# EAGLE design LowLevelv2 (EAGLE 8.1.0)

## Sheet 1 of 2
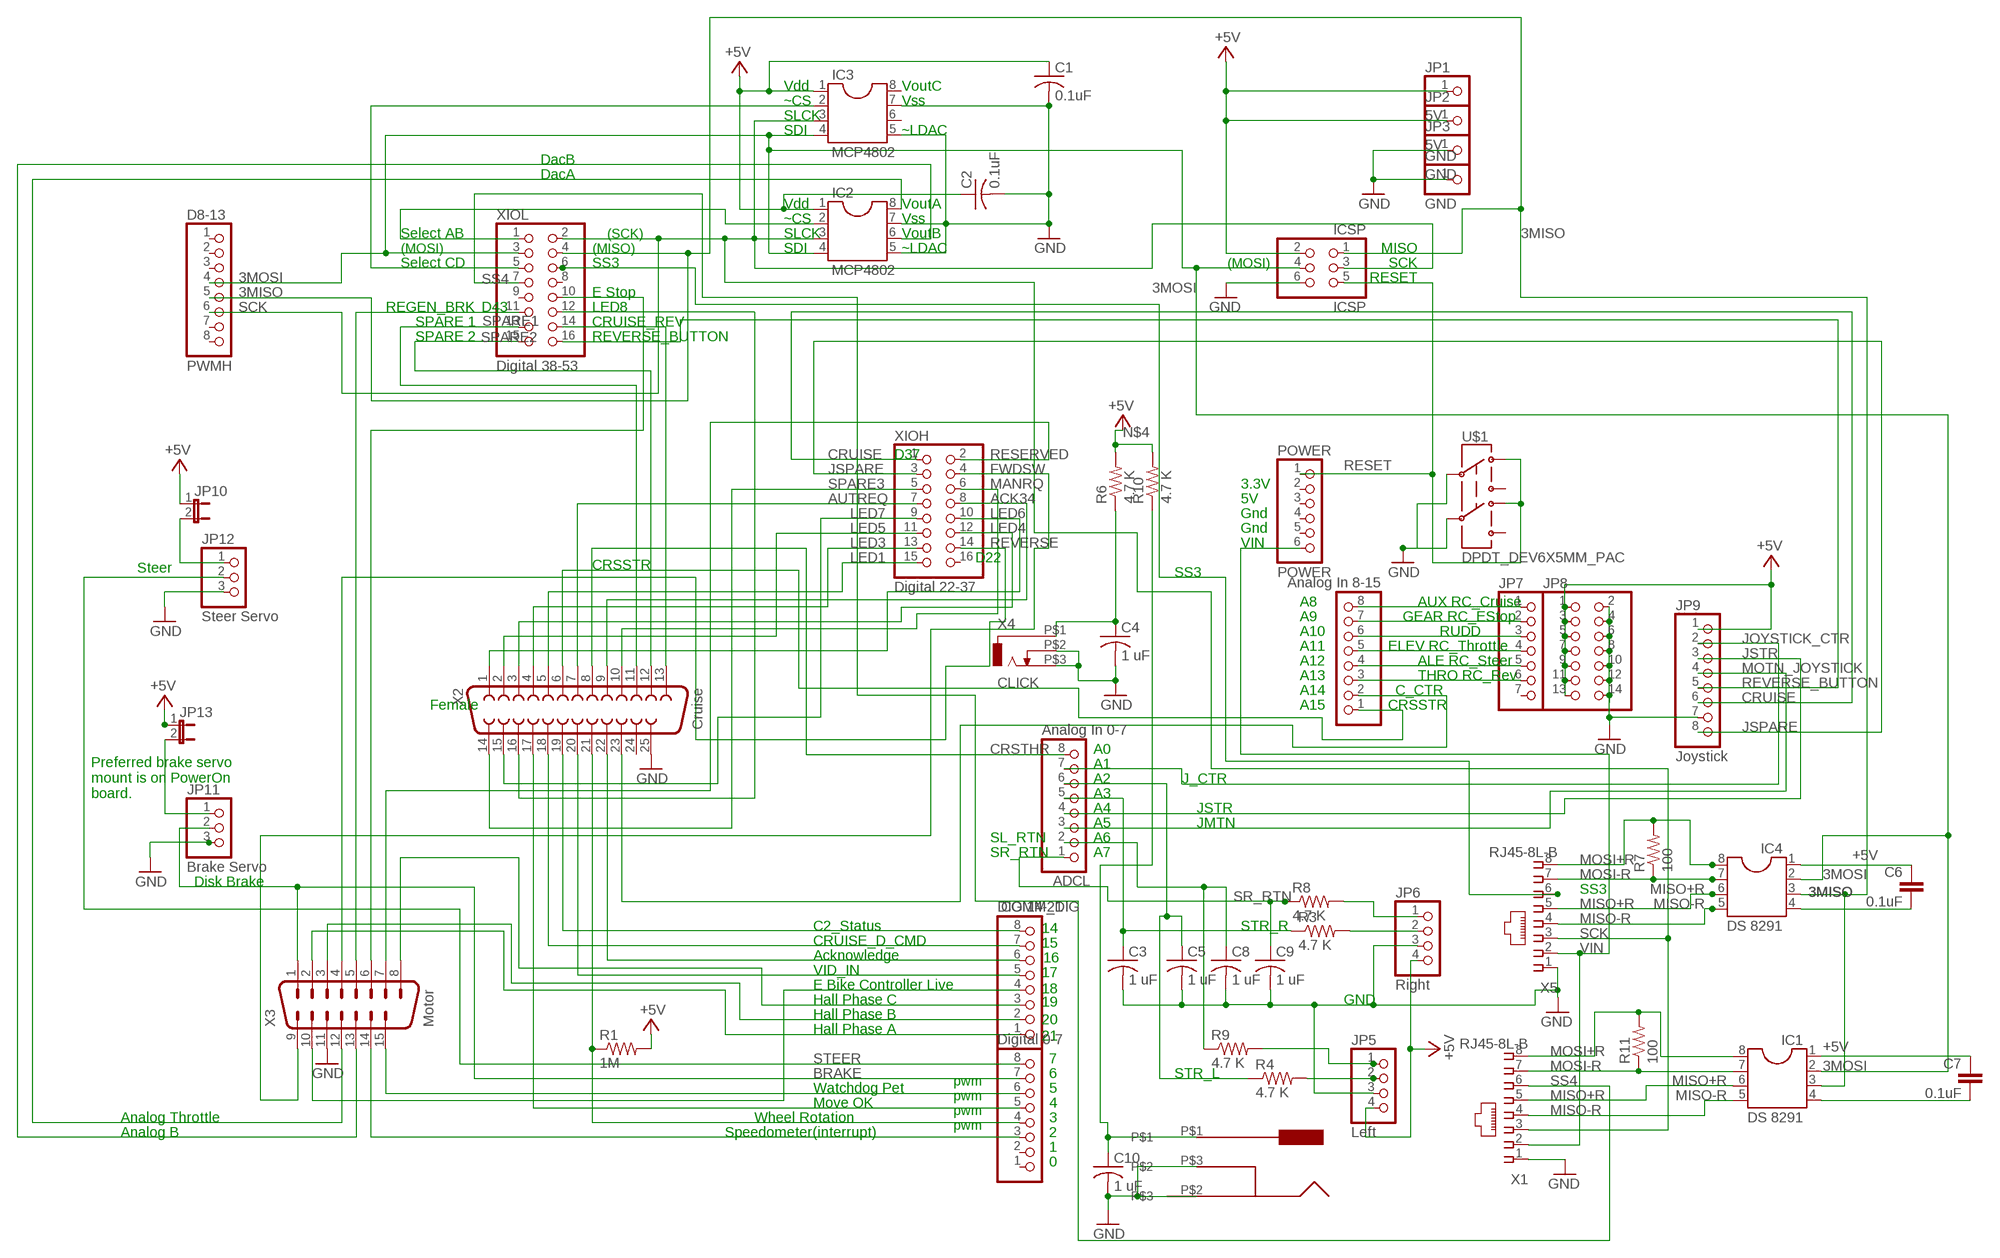
[diagram p0: schematic, sheet 1]

### Parts
ADCH  Analog In 8-15  PINHD-1X8  [1X08]
ADCL  Analog In 0-7  PINHD-1X8  [1X08]
C1  0.1uF  C-US025-025X050  [C025-025X050]
C2  0.1uF  C-US025-025X050  [C025-025X050]
C3  1 uF  C-US025-030X050  [C025-030X050]
C4  1 uF  C-US025-030X050  [C025-030X050]
C5  1 uF  C-US025-030X050  [C025-030X050]
C6  0.1uF  C2.5/2  [C2.5-2]
C7  0.1uF  C2.5/2  [C2.5-2]
C8  1 uF  C-US025-030X050  [C025-030X050]
C9  1 uF  C-US025-030X050  [C025-030X050]
C10  1 uF  C-US025-030X050  [C025-030X050]
COMM_DIG  DIG 14-21  PINHD-1X8  [1X08]
D8-13  PWMH  PINHD-1X8  [1X08]
GND  GND  PINHD-1X1  [1X01]
IC1  DS 8291  DIL8  [DIL08]
IC2  MCP4802  DIL8  [DIL08]
IC3  MCP4802  DIL8  [DIL08]
IC4  DS 8291  DIL8  [DIL08]
ICSP  ICSP  PINHD-2X3  [2X03]
JP1  5V  PINHD-1X1  [1X01]
JP2  5V  PINHD-1X1  [1X01]
JP3  GND  PINHD-1X1  [1X01]
JP5  Left  PINHD-1X4/90  [1X04/90]
JP6  Right  PINHD-1X4/90  [1X04/90]
JP7  PINHD-1X7  [1X07]
JP8  PINHD-2X7  [2X07]
JP9  Joystick  PINHD-1X8/90  [1X08/90]
JP10  JP1E  [JP1]
JP11  Brake Servo  PINHD-1X3/90  [1X03/90]
JP12  Steer Servo  PINHD-1X3/90  [1X03/90]
JP13  JP1E  [JP1]
POWER  POWER  PINHD-1X6  [1X06]
PWML  Digital 0-7  PINHD-1X8  [1X08]
R1  1M  R-US_0207/10  [0207/10]
R3  4.7 K  R-US_0207/10  [0207/10]
R4  4.7 K  R-US_0207/10  [0207/10]
R6  4.7 K  R-US_0207/10  [0207/10]
R7  100  R-US_0207/10  [0207/10]
R8  4.7 K  R-US_0207/10  [0207/10]
R9  4.7 K  R-US_0207/10  [0207/10]
R10  4.7 K  R-US_0207/10  [0207/10]
R11  100  R-US_0207/10  [0207/10]
U$1  DPDT_DEV6X5MM_PAC  [NEWSWITCH2_PAC]
U$2  CUI_JACKTHROUGH_HOLE  [CUIJACK]
X1  RJ45-8L-B  [RJ45-NO-SHIELD]
X2  Cruise  F25H  [F25H]
X3  Motor  M15-182  [182-015-MALE]
X4  CLICK  ODO_JACK  [ODO_JACK]
X5  RJ45-8L-B  [RJ45-NO-SHIELD]
XIOH  Digital 22-37  PINHD-2X8  [2X08]
XIOL  Digital 38-53  PINHD-2X8  [2X08]

### Nets
1C: ADCH.6 JP7.3
3A: ADCH.3 JP7.6
3MISO: D8-13.5 IC1.3 IC4.3 ICSP.1 XIOL.4
3MOSI: D8-13.4 IC1.2 IC2.4 IC3.4 IC4.2 ICSP.4 XIOL.3
5V: JP10.2 JP12.1
5VOLT: JP11.1 JP13.2
+5V: C1.1 C2.1 C6.1 IC2.1 IC3.1 IC4.1 ICSP.2 JP1.1 JP2.1 JP5.4 JP6.4 JP8.1 JP8.3 JP8.5 JP8.7 JP8.9 JP8.11 JP8.13 JP9.1 JP10.1 JP13.1 R1.2 R6.2 R10.2
A14: ADCH.7 JP7.2
A15: ADCH.8 JP7.1
ACK34: X2.9 XIOH.8
ACKNOWLEDGE: COMM_DIG.6 X2.22
AUTREQ: X2.7 XIOH.7
BRAKE: JP11.2 PWML.7 X3.1
C2STATUS: COMM_DIG.8 X2.19
C_CTR: ADCH.2 X2.23
CRSSTR: ADCH.1 X2.6
CRSTHR: ADCL.8 X2.8
CRUISE: JP9.6 XIOH.1
CRUISE_D_CMD: COMM_DIG.7 X2.18
CRUISE_REV: X2.13 XIOL.14
DACA: IC2.8 X3.12
DACB: IC2.6 X3.13
EBIKECONTRL: COMM_DIG.4 X3.10
ESTOP: X3.6 XIOL.10
FWDSW: X3.9 XIOH.4
GND: C1.2 C2.2 C3.2 C4.2 C5.2 C8.2 C9.2 C10.2 GND.1 IC2.5 IC2.7 IC3.5 IC3.7 ICSP.6 JP3.1 JP5.3 JP6.3 JP8.2 JP8.4 JP8.6 JP8.8 JP8.10 JP8.12 JP8.14 JP9.7 JP11.3 JP12.3 U$1.PIN2 U$1.PIN5 U$2.P$2 U$2.P$3 X1.1 X2.25 X3.11 X4.P$2 X4.P$3 X5.1
HALLPHASEA: COMM_DIG.1 X3.2
HALLPHASEB: COMM_DIG.2 X3.3
HALLPHASEC: COMM_DIG.3 X3.8
JOYSTICK_CTR: ADCL.7 JP9.2
JSPARE: JP9.8 XIOH.3
JSTR: ADCL.4 JP9.3
L_STR: JP5.2 R4.2
LED1: X2.5 XIOH.15
LED3: X2.4 XIOH.13
LED4: X2.3 XIOH.12
LED5: X2.2 XIOH.11
LED6: X2.1 XIOH.10
LED7: X2.15 XIOH.9
LED8: X2.16 XIOL.12
MANRQ: X2.10 XIOH.6
MISO+R: IC1.6 IC4.6 X1.5 X5.5
MISO-R: IC1.5 IC4.5 X1.4 X5.4
MOSI+R: IC1.8 IC4.8 R7.2 R11.2 X1.8 X5.8
MOSI-R: IC1.7 IC4.7 R7.1 R11.1 X1.7 X5.7
MOTN_JOYSTICK: ADCL.3 JP9.4
MOVEOK: PWML.5 X2.17
N$1: C10.1 R10.1 U$2.P$1
N$2: C6.2 IC4.4
N$3: C7.2 IC1.4
N$4: C4.1 R6.1 X4.P$1
N$5: C7.1 IC1.1
N$27: ADCH.4 JP7.5
N$28: ADCH.5 JP7.4
R_STR: JP6.2 R3.2
REGENBAKE: X3.5 XIOL.11
RESERVED: X3.7 XIOH.2
RESET: ICSP.5 POWER.1 U$1.PIN1 U$1.PIN4
REVERSE: X3.4 XIOH.14
REVERSE_BUTTON: JP9.5 XIOL.16
SCK: D8-13.6 IC2.3 IC3.3 ICSP.3 X1.3 X5.3 XIOL.2
SELECTAB: IC2.2 XIOL.1
SELECTCD: IC3.2 XIOL.5
SL_RET: JP5.1 R9.2
SL_RTN: ADCL.2 C8.1 R9.1
SPARE1: X2.11 XIOL.13
SPARE2: X2.12 XIOL.15
SPARE3: X2.14 XIOH.5
SPEEDOMETER: PWML.3 X3.14
SR_RET: JP6.1 R8.2
SR_RTN: ADCL.1 C9.1 R8.1
SS3: X5.6 XIOL.6
SS4: X1.6 XIOL.7
STEER: JP12.2 PWML.8
STR_L: ADCL.6 C5.1 R4.1
STR_R: ADCL.5 C3.1 R3.1
VIDIN: COMM_DIG.5 X2.20
VIN: POWER.6 X1.2 X5.2
WATCHDOG: PWML.6 X3.15
WHEELROTATION: PWML.4 R1.1 X2.21
Unconnected: D8-13.1 D8-13.2 D8-13.3 D8-13.7 D8-13.8 IC3.6 IC3.8 JP7.7 POWER.2 POWER.3 POWER.4 POWER.5 PWML.1 PWML.2 U$1.PIN3 U$1.PIN6 X2.24 XIOH.16 XIOL.8 XIOL.9

### Notes on the sheet
- Vdd | VoutC
- ~CS | Vss
- SLCK
- SDI | ~LDAC
- DacB
- DacA
- Vdd | VoutA
- ~CS | Vss
- Select AB | (SCK) | SLCK | VoutB
- (MOSI) | (MISO) | SDI | ~LDAC | MISO
- Select CD | SS3 | (MOSI) | SCK
- RESET
- E Stop
- REGEN_BRK | D43
- SPARE 1
- SPARE 2
- D37
- 3.3V
- 5V
- Gnd
- Gnd
- VIN
- Steer | D22
- CRSSTR
- SS3
- A8 | AUX RC_Cruise
- A9 | GEAR RC_EStop
- A10 | RUDD
- A11 | ELEV RC_Throttle
- A12 | ALE RC_Steer
- A13 | THRO RC_Rev
- A14 | C_CTR
- Female | A15 | CRSSTR
- A0
- A1
- A2 | J_CTR
- Preferred brake servo
  mount is on PowerOn
  board.
- A3
- A4 | JSTR
- A5 | JMTN
- SL_RTN | A6
- SR_RTN | A7
- Disk Brake
- SS3
- C2_Status | 14 | STR_R
- 15
- Acknowledge | 16
- VID_IN | 17
- E Bike Controller Live | 18
- Hall Phase C | 19 | GND
- Hall Phase B
- 20
- Hall Phase A
- 21
- 7
- 6 | STR_L
- pwm
- Watchdog Pet | 5
- pwm
- Move OK | 4
- pwm
- Analog Throttle | Wheel Rotation | 3
- pwm
- Analog B | Speedometer(interrupt) | 2
- 1
- 0

## Sheet 2 of 2

## Library data of the parts
ADCH ADCL COMM_DIG D8-13 JP9 PWML = pinhead:PINHD-1X8: PIN HEADER
C1-C5 C8-C10 = rcl:C-US: CAPACITOR, American symbol
C6 C7 = capacitor-wima:C: CAPACITOR naming: grid - package width
GND JP1-JP3 = pinhead:PINHD-1X1: PIN HEADER
IC1-IC4 = ic-package:DIL8: Dual In Line / Socket
ICSP = pinhead:PINHD-2X3: PIN HEADER
JP5 JP6 = pinhead:PINHD-1X4: PIN HEADER
JP7 = pinhead:PINHD-1X7: PIN HEADER
JP8 = pinhead:PINHD-2X7: PIN HEADER
JP10 JP13 = jumper:JP1E: JUMPER
JP11 JP12 = pinhead:PINHD-1X3: PIN HEADER
POWER = pinhead:PINHD-1X6: PIN HEADER
R1 R3 R4 R6-R11 = rcl:R-US_: RESISTOR, American symbol
U$1 = elcanoParts:DPDT_DEV
U$2 = Elcano:CUI_JACK
X1 X5 = con-tycoelectronics:RJ45: CORCOM Modular RJ Jacks No Shield Source: www.tycoelectronics.com .. ENG_DS_1654001_1099_RJ_L_0507.pdf; MF: TYCO ELECTRONICS; MPN: RJ45-8L-B; OC_FARNELL: 1279843; OC_NEWARK: 52K4445
X2 = con-subd:F25: SUB-D; OC_FARNELL: unknown; OC_NEWARK: unknown
X3 = con-subd:M15: SUB-D; OC_FARNELL: unknown; OC_NEWARK: unknown
X4 = Elcano:ODO_JACK
XIOH XIOL = pinhead:PINHD-2X8: PIN HEADER

## Net classes
0 default: width 0.178 mm, drill 0.305 mm, clearance 0.178 mm
1 Power: width 0.508 mm, drill 0.305 mm, clearance 0.254 mm

## Board
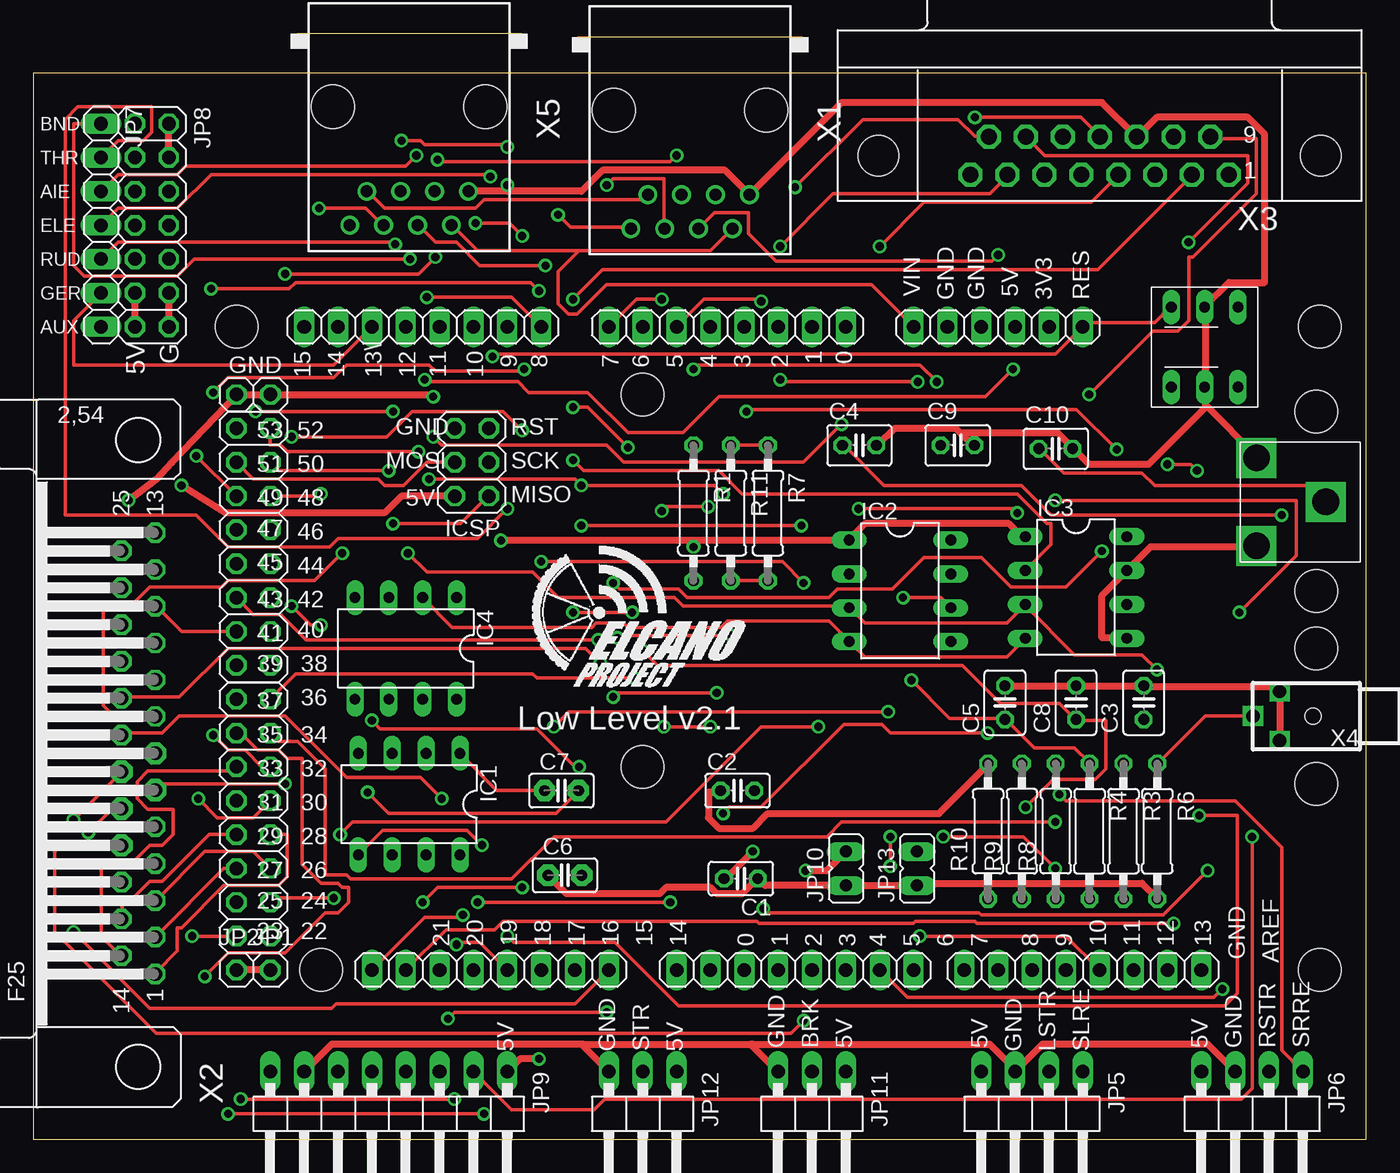
[diagram p1: board, top side]
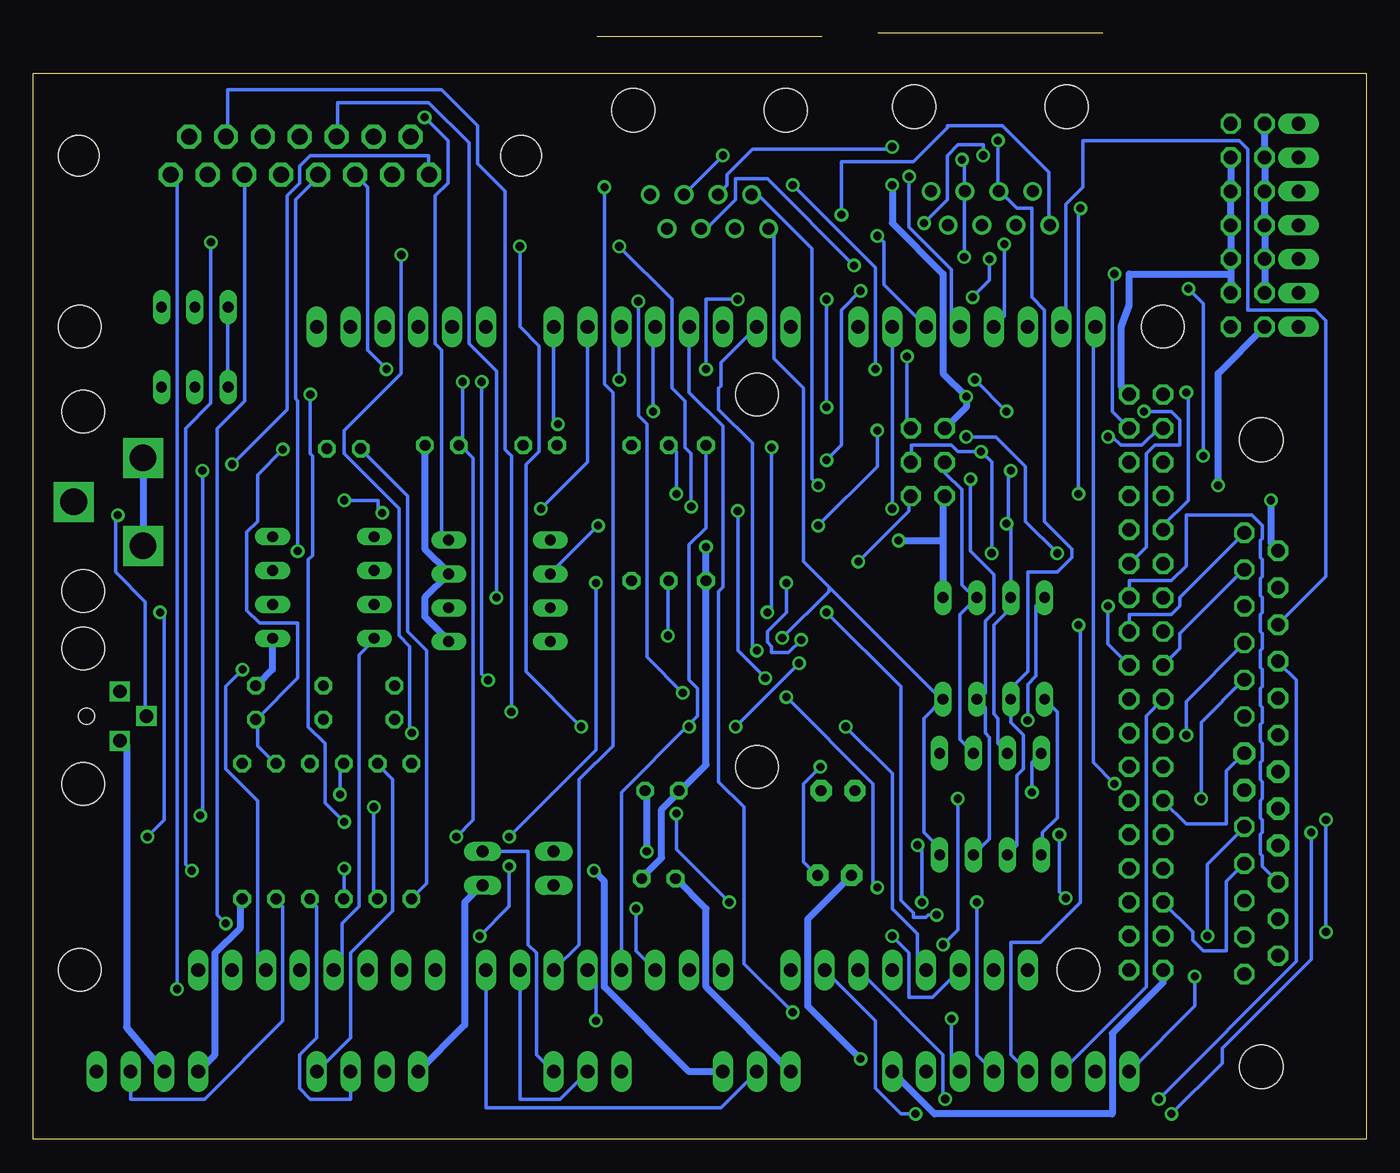
[diagram p2: board, bottom side, seen from below]

Size 100 x 80 mm. Coordinates in mm from the lower left corner, seen from the top.
Outline: 0,0 100,0 100,80 0,80 0,0
Copper layers (1*16): Top 0.035mm / dielectric 1.5mm / Bottom 0.035mm
Design rules "default": minimum track width 10mil, minimum drill 24mil, track to track 8mil, track to pad 8mil, pad to pad 8mil, via to via 8mil, smd to smd 8mil, copper to edge 40mil, drill to drill 8mil, minimum pad ring 10mil, minimum via ring 8mil, stop-mask expansion 4mil, vias tented up to drill 0mil, thermal gap 10mil
Holes 3.2 mm at 96.27,36.83 96.27,26.67 96.27,41.15 96.27,54.61 21.59,12.7 96.52,12.7 15.24,60.96 96.52,60.96 45.72,55.88 45.72,27.94

### Footprints (pad centres in the part's own frame; a part is rotated, then mirrored left to right if it is on the bottom)
1X08 = drill 1.016 long: 1 -8.89,0; 2 -6.35,0; 3 -3.81,0; 4 -1.27,0; 5 1.27,0; 6 3.81,0; 7 6.35,0; 8 8.89,0
C025-025X050 = drill 0.813 octagon: 1 -1.27,0; 2 1.27,0
C025-030X050 = drill 0.813 octagon: 1 -1.27,0; 2 1.27,0
C2.5-2 = drill 0.813 pad 1.6 octagon: 1 -1.27,0; 2 1.27,0
1X01 = drill 1.016 octagon: 1 0,0
DIL08 = drill 0.813 long: 1 -3.81,-3.81; 2 -1.27,-3.81; 3 1.27,-3.81; 4 3.81,-3.81; 5 3.81,3.81; 6 1.27,3.81; 7 -1.27,3.81; 8 -3.81,3.81
2X03 = drill 1.016 octagon: 1 -2.54,-1.27; 2 -2.54,1.27; 3 0,-1.27; 4 0,1.27; 5 2.54,-1.27; 6 2.54,1.27
1X04/90 = drill 1.016 long: 1 -3.81,-3.81; 2 -1.27,-3.81; 3 1.27,-3.81; 4 3.81,-3.81
1X07 = drill 1.016 long: 1 -7.62,0; 2 -5.08,0; 3 -2.54,0; 4 0,0; 5 2.54,0; 6 5.08,0; 7 7.62,0
2X07 = drill 1.016 octagon: 1 -7.62,-1.27; 2 -7.62,1.27; 3 -5.08,-1.27; 4 -5.08,1.27; 5 -2.54,-1.27; 6 -2.54,1.27; 7 0,-1.27; 8 0,1.27; 9 2.54,-1.27; 10 2.54,1.27; 11 5.08,-1.27; 12 5.08,1.27; 13 7.62,-1.27; 14 7.62,1.27
1X08/90 = drill 1.016 long: 1 -8.89,-3.81; 2 -6.35,-3.81; 3 -3.81,-3.81; 4 -1.27,-3.81; 5 1.27,-3.81; 6 3.81,-3.81; 7 6.35,-3.81; 8 8.89,-3.81
JP1 = drill 0.914 long: 1 0,-1.27; 2 0,1.27
1X03/90 = drill 1.016 long: 1 -2.54,-3.81; 2 0,-3.81; 3 2.54,-3.81
1X06 = drill 1.016 long: 1 -6.35,0; 2 -3.81,0; 3 -1.27,0; 4 1.27,0; 5 3.81,0; 6 6.35,0
0207/10 = drill 0.813 octagon: 1 -5.08,0; 2 5.08,0
NEWSWITCH2_PAC = drill 0.8 long: PIN1 -2.5,3; PIN2 0,3; PIN3 2.5,3; PIN4 -2.5,-3; PIN5 0,-3; PIN6 2.5,-3
CUIJACK = drill 2 pad 2.184 square: P$1 2.6,4.5; P$2 7.8,1.2; P$3 7.8,7.8
RJ45-NO-SHIELD = drill 0.9 pad 1.4: 1 -4.445,6.35; 2 -3.175,8.89; 3 -1.905,6.35; 4 -0.635,8.89; 5 0.635,6.35; 6 1.905,8.89; 7 3.175,6.35; 8 4.445,8.89 | hole 3.251: -5.715,0; 5.715,0
F25H = drill 1.016 octagon: 1 -16.561,-1.27; 2 -13.792,-1.27; 3 -11.049,-1.27; 4 -8.28,-1.27; 5 -5.512,-1.27; 8 2.769,-1.27; 9 5.512,-1.27; 10 8.28,-1.27; 11 11.049,-1.27; 12 13.792,-1.27; 13 16.561,-1.27; 14 -15.189,1.27; 15 -12.421,1.27; 16 -9.652,1.27; 20 1.372,1.27; 21 4.14,1.27; 22 6.909,1.27; 23 9.652,1.27; 24 12.421,1.27; 25 15.189,1.27 | drill 1.016 pad 1.67 octagon: 6 -2.769,-1.27; 7 0,-1.27; 17 -6.909,1.27; 18 -4.14,1.27; 19 -1.372,1.27 | hole 3.302: -23.52,0; 23.52,0
182-015-MALE = drill 1.194 pad 1.524 octagon: 1 -9.69,10.923; 2 -6.921,10.923; 3 -4.153,10.923; 4 -1.384,10.923; 5 1.384,10.923; 6 4.153,10.923; 7 6.921,10.923; 8 9.69,10.923; 9 -8.306,8.08; 10 -5.537,8.08; 11 -2.769,8.08; 12 0,8.08; 13 2.769,8.08; 14 5.537,8.08; 15 8.306,8.08 | hole 3.048: -16.599,9.501; 16.599,9.501
ODO_JACK = drill 1 square: P$1 4.5,0; P$2 2.5,1.85; P$3 2.5,-1.85 | hole 1.2: 0,0
2X08 = drill 1.016 octagon: 1 -8.89,-1.27; 2 -8.89,1.27; 3 -6.35,-1.27; 4 -6.35,1.27; 5 -3.81,-1.27; 6 -3.81,1.27; 7 -1.27,-1.27; 8 -1.27,1.27; 9 1.27,-1.27; 10 1.27,1.27; 11 3.81,-1.27; 12 3.81,1.27; 13 6.35,-1.27; 14 6.35,1.27; 15 8.89,-1.27; 16 8.89,1.27

### Placement (x,y rotation side)
ADCH  29.21,60.96 0 top
ADCL  52.07,60.96 0 top
C1  53.09,19.56 180 top
C2  52.83,26.16 0 top
C3  83.31,32.77 90 top
C4  61.98,52.07 0 top
C5  72.9,32.77 90 top
C6  39.88,19.81 0 top
C7  39.62,26.16 0 top
C8  78.23,32.77 90 top
C9  69.34,52.07 0 top
C10  76.71,51.82 0 top
COMM_DIG  34.29,12.7 0 top
D8-13  78.74,12.7 0 top
GND  15.24,55.88 0 top
IC1  28.19,25.15 180 top
IC2  65.02,41.15 270 top
IC3  78.23,41.4 270 top
IC4  27.94,36.83 180 top
ICSP  32.89,50.8 90 top
JP1  17.78,12.7 0 top
JP2  15.24,12.7 0 top
JP3  17.78,55.88 0 top
JP5  74.93,1.27 180 top
JP6  91.44,1.27 180 top
JP7  5.08,68.58 270 top
JP8  8.89,68.58 270 top
JP9  26.67,1.27 180 top
JP10  60.96,20.32 0 top
JP11  58.42,1.27 180 top
JP12  45.72,1.27 180 top
JP13  66.29,20.32 0 top
POWER  72.39,60.96 180 top
PWML  57.15,12.7 0 top
R1  49.53,46.99 270 top
R3  81.79,23.11 270 top
R4  79.25,23.11 270 top
R6  84.33,23.11 270 top
R7  55.12,46.99 270 top
R8  76.71,23.11 90 top
R9  74.17,23.11 90 top
R10  71.63,23.11 90 top
R11  52.32,46.99 270 top
U$1  87.88,59.44 0 top
U$2  99.57,52.32 180 top
X1  49.28,77.22 180 top
X2  7.87,28.96 90 top
X3  80.01,83.31 180 top
X4  96.01,31.75 180 top
X5  28.19,77.47 180 top
XIOH  16.51,24.13 270 top
XIOL  16.51,44.45 270 top

### Tracks (layer width: path | path; a pad name or v marks a point on that pad's centre or on a via)
1C  (via drill 0.61)
  Top 0.254: v36.67,67.79 35.72,68.74 v33.18,68.74 | v28.73,73.82 27.94,73.03 11.43,73.03 10.79,72.39 6.35,72.39 JP7.3
  Bottom 0.254: ADCH.6 36.2,64.14 36.2,67.31 v36.67,67.79 | v33.18,68.74 31.43,70.48 31.43,73.82 30.64,74.61 28.73,74.61 v28.73,73.82
3A
  Top 0.254: JP7.6 3.02,61.44 3.02,58.1 22.54,58.1 ADCH.3
3MISO  (via drill 0.61)
  Top 0.254: v26.99,46.2 32.07,46.2 34.13,48.26 ICSP.1 | XIOL.4 18.41,50.16 v26.67,50.16 | D8-13.5 77.47,15.24 v66.52,15.24 | v64.29,22.7 v64.29,20.48 | v57.78,41.75 56.2,43.34 v38.1,43.34
  Bottom 0.254: IC1.3 26.99,29.05 27.62,29.69 27.62,31.59 27.94,31.91 27.94,38.58 26.67,39.85 IC4.3 26.67,45.88 v26.99,46.2 26.83,46.2 26.83,50.01 v26.67,50.16 | v66.52,15.24 64.29,17.46 v64.29,20.48 | v64.29,22.7 57.78,29.21 v57.78,41.75 | v38.1,43.34 34.29,47.15 34.29,48.26 ICSP.1
3MOSI
  Top 0.254: XIOL.3 16.51,49.53 25.88,49.53 26.35,49.05 27.78,49.05 29.53,50.8 ICSP.4 | IC3.4 73.03,36.2 62.39,36.2 61.28,37.31 IC2.4 61.12,37.47 59.69,38.89 52.07,38.89 51.59,38.42 44.61,38.42 44.29,38.73 42.23,38.73 41.91,38.42 31.43,38.42 IC4.2
  Bottom 0.254: IC1.2 29.53,29.05 30.48,30 30.48,39.37 IC4.2 29.37,40.64 30.32,41.59 30.32,48.74 31.59,50.01 31.59,50.8 ICSP.4 | D8-13.4 76.83,13.34 76.83,16.19 75.56,17.46 75.56,36.35 74.45,37.47 IC3.4
5V  (via drill 0.61)
  Top 0.508: JP10.2 59.53,20.16 v57.94,20.16
  Bottom 0.508: v57.94,20.16 57.15,19.37 57.15,11.43 50.8,5.08 JP12.1
5VOLT
  Bottom 0.254: JP13.2 62.87,21.59 62.87,14.61 62.23,13.97 62.23,6.35 JP11.1
+5V  (via drill 0.61)
  Top 0.254: 61.12,44.93 IC2.1 | 54.29,19.53 C1.1
  Top 0.508: JP8.11 JP8.13 | IC2.1 61.28,45.09 62.39,46.2 73.18,46.2 74.14,45.24 74.3,45.24 IC3.1 | 61.12,44.93 49.53,44.93 | 49.53,44.93 v35.08,44.93 | v11.11,49.05 14.45,46.99 26.35,46.99 27.62,48.26 ICSP.2 | JP1.1 JP2.1 | C1.1 54.45,19.53 54.93,19.05 JP10.1 JP13.1 66.36,19.05 66.52,19.21 83.19,19.21 84.3,18.1 R6.2 | R10.2 71.6,28.1 67.94,24.45 55.09,24.45 53.98,23.34 51.44,23.34 50.64,24.13 50.64,26.04 51.44,26.04 C2.1 | C6.1 40.01,18.41 46.99,18.41 47.47,18.89 50.8,18.89 51.28,18.41 53.18,18.41 54.29,19.53 | JP9.1 36.51,6.03 v37.94,6.03 | v49.53,44.45 49.53,44.93
  Bottom 0.254: 51.59,26.04 C2.1 | 54.29,19.68 C1.1 | 66.36,19.05 JP13.1
  Bottom 0.508: JP8.1 JP8.3 JP8.5 JP8.7 JP8.9 JP8.11 | 31.75,44.93 31.75,48.26 ICSP.2 | 31.75,44.93 IC4.1 | v35.08,44.93 31.75,44.93 | JP8.13 11.11,57.47 v11.11,49.05 | JP9.1 32.38,1.91 19.05,1.91 19.05,7.94 15.24,11.75 JP2.1 | JP6.4 86.36,6.35 86.36,13.97 84.45,15.88 84.45,17.94 R6.2 | 51.59,26.04 52.86,24.77 52.86,21.11 54.29,19.68 | C2.1 51.44,26.19 49.53,28.1 R1.2 v49.53,44.45 | JP5.4 67.63,8.57 67.63,17.78 66.36,19.05 | v37.94,6.03 41.91,10 41.91,16.51 C6.1
A14  (via drill 0.61)
  Top 0.254: JP7.2 6.35,74.93 8.26,74.93 8.89,75.56 8.89,77.47 3.33,77.47 2.38,76.52 2.38,46.83 12.22,46.83 14.61,44.45 22.23,44.45 22.86,45.09 33.34,45.09 v35.56,47.31
  Bottom 0.254: ADCH.7 v35.56,47.31
A15  (via drill 0.61)
  Top 0.254: ADCH.8 35.88,63.18 v29.53,63.18 | v28.26,66.04 12.06,66.04 10.79,64.77 3.81,64.77 3.02,65.56 3.02,76.2 JP7.1
  Bottom 0.254: v29.53,63.18 28.26,64.45 v28.26,66.04
ACK34  (via drill 0.61)
  Top 0.254: v12.38,25.56 13.81,24.13 16.51,24.13 XIOH.8
  Bottom 0.254: v12.38,25.56 12.38,31.27 9.21,34.45 X2.9
ACKNOWLEDGE  (via drill 0.61)
  Top 0.254: v31.59,3.02 v15.56,3.02
  Bottom 0.254: v15.56,3.02 5.24,13.34 5.24,34.45 6.51,35.72 X2.22 | v31.59,3.02 31.75,3.17 31.75,6.35 COMM_DIG.6
AUTREQ
  Bottom 0.254: XIOH.7 13.49,23.65 10.48,23.65 10.48,27.62 X2.7
BRAKE  (via drill 0.61)
  Top 0.254: v89.22,11.27 88.58,10.64 65.56,10.64 PWML.7
  Bottom 0.254: JP11.2 60.48,3.02 63.5,3.02 PWML.7 | v89.22,11.27 89.22,71.75 89.69,72.23 X3.1
C2STATUS  (via drill 0.61)
  Top 0.254: COMM_DIG.8 40.64,10.16 22.7,10.16 22.38,9.84 8.73,9.84 v3.02,15.56 | v3.02,23.97 6.51,27.46 X2.19
  Bottom 0.254: v3.02,23.97 v3.02,15.56
C_CTR
  Bottom 0.254: ADCH.2 22.54,61.28 22.54,70.17 21.27,71.44 21.27,74.93 9.53,74.93 8.89,74.3 8.89,62.23 3.81,62.23 3.02,61.44 3.02,42.23 6.51,38.73 X2.23
CRSSTR  (via drill 0.61)
  Top 0.254: v18.89,26.67 9.68,26.67 9.21,26.19 X2.6
  Bottom 0.254: ADCH.1 20.48,60.8 20.48,28.26 v18.89,26.67
CRSTHR  (via drill 0.61)
  Top 0.254: v23.18,43.97 21.11,41.91 14.61,41.91 14.13,41.43 8.73,41.43 7.3,40.01 5.24,40.01 5.24,32.54 6.03,31.75 9.05,31.75 X2.8 | v30,52.7 30.64,52.07 43.02,52.07 44.29,50.8 57.78,50.8 v60.64,53.66
  Bottom 0.254: v23.18,43.97 25.56,46.35 25.56,50.48 27.78,52.7 v30,52.7 | v60.64,53.66 60.96,53.98 ADCL.8
CRUISE
  Bottom 0.254: JP9.6 16.51,11.43 16.51,31.75 XIOH.1
CRUISE_D_CMD  (via drill 0.61)
  Top 0.254: v14.61,1.91 v33.81,1.91 | v4.13,23.02 5.87,24.77 6.51,24.77 X2.18
  Bottom 0.254: COMM_DIG.7 36.83,8.89 36.83,3.81 34.92,1.91 v33.81,1.91 | v14.61,1.91 10.79,5.71 10.79,6.83 4.13,13.49 v4.13,23.02
CRUISE_REV
  Bottom 0.254: XIOL.14 17.78,39.37 14.61,39.37 13.97,40.01 13.97,40.64 9.21,45.4 X2.13
DACA  (via drill 0.61)
  Top 0.254: v70.64,76.68 78.58,76.68 80.01,75.25 X3.12
  Bottom 0.254: v70.64,76.68 68.9,74.93 68.9,71.75 69.85,70.8 69.85,59.69 69.37,59.21 69.37,45.56 68.9,45.09 IC2.8
DACB  (via drill 0.61)
  Top 0.254: v65.25,40.64 68.1,40.64 68.74,40.01 IC2.6
  Bottom 0.254: v65.25,40.64 65.25,57.63 67.31,59.69 67.31,74.77 70.33,77.79 77.15,77.79 77.15,75.25 X3.13
EBIKECONTRL  (via drill 0.61)
  Top 0.254: v39.05,30.96 40.16,32.07 v64.14,32.07
  Bottom 0.254: COMM_DIG.4 33.66,13.34 33.66,15.4 35.56,17.3 35.56,27.46 v39.05,30.96 | v64.14,32.07 64.14,51.28 64.61,51.75 64.61,71.12 66.67,73.18 66.67,76.04 69.37,78.74 85.41,78.74 85.41,75.25 X3.10
ESTOP  (via drill 0.61)
  Top 0.254: v26.99,54.61 v16.67,54.61 | v29.37,56.99 29.53,56.83 36.35,56.83 37.15,56.04 41.59,56.04 44.61,53.02 48.74,53.02 51.44,55.72 71.44,55.72 v73.5,57.78
  Bottom 0.254: XIOL.10 16.51,44.45 16.51,51.44 15.88,52.07 13.97,52.07 13.97,53.98 14.61,54.61 v16.67,54.61 | v29.37,56.99 v26.99,54.61 | v73.5,57.78 74.93,59.21 74.93,71.44 75.72,72.23 X3.6
FWDSW  (via drill 0.61)
  Top 0.254: XIOH.4 18.41,29.84 19.84,29.84 21.91,27.78 21.91,19.84 23.5,19.84 23.81,19.53 35.88,19.53 39.05,22.7 59.53,22.7 60.64,23.81 v76.68,23.81 | v79.22,55.88 83.98,60.64 85.88,60.64 86.68,61.44 86.68,66.2 87,66.2 91.76,70.96 91.76,75.09 88.42,75.09 X3.9
  Bottom 0.254: v76.68,23.81 78.11,25.24 78.11,29.69 79.38,30.96 79.38,43.5 79.06,43.81 79.06,51.28 79.22,51.44 v79.22,55.88
GND  (via drill 0.61)
  Top 0.254: 51.91,19.68 52.07,19.68 | 41.12,7.14 41.2,7.06 41.27,7.14 | 53.82,7.14 53.9,7.06 53.98,7.14 | 73.66,5.24 JP5.3 | 73.03,33.97 C5.2 | 78.11,33.97 C8.2 78.26,33.97 | 93.5,33.5 X4.P$3 | 83.34,33.97 C3.2 | 63.34,52.07 C4.2 | 77.95,51.91 C10.2 | 69.69,53.02 69.61,52.94 | 53.66,70.96 X1.1 | 87.95,56.52 U$1.PIN5 87.95,56.36 | 87.95,62.39 U$1.PIN2 87.95,62.55 | 87.95,55.09 88.03,55.01 | 82.71,75.25 X3.11 | 91.76,44.45 U$2.P$3
  Top 0.508: JP5.3 75.72,7.14 88.11,7.14 JP6.3 | 52.07,19.68 v53.98,21.59 | 51.91,19.68 C1.2 | JP9.7 22.38,7.14 41.12,7.14 | JP12.3 41.2,7.06 | 53.9,7.06 JP11.3 | 41.27,7.14 53.82,7.14 | 73.66,5.24 71.75,7.14 53.98,7.14 | JP8.4 JP8.2 | JP8.12 JP8.14 | v7.14,47.94 9.21,49.5 10.38,50.77 GND.1 JP3.1 29.84,55.88 v30,55.72 | 78.11,33.97 73.03,33.97 | 93.5,33.5 93.5,30 X4.P$2 | IC3.5 81.92,37.62 80.17,37.62 80.17,40.8 IC3.7 83.82,44.45 91.76,44.45 | 83.34,33.97 93.19,33.97 93.5,33.66 X4.P$3 | 78.26,33.97 83.19,33.97 C3.2 | 63.34,52.07 64.61,53.34 69.22,53.34 69.61,52.94 70.48,52.07 C9.2 | 77.95,51.91 76.83,53.02 69.69,53.02 | 35.56,71.12 41.12,71.12 42.7,72.71 51.91,72.71 53.66,70.96 | 35.56,71.12 X5.1 | 87.95,62.39 87.95,56.52 | 87.95,62.55 89.69,64.29 92.39,64.29 92.39,75.41 91.12,76.68 84.3,76.68 82.87,75.25 X3.11 | 87.95,56.36 87.95,55.09 | U$2.P$2 91.76,51.28 88.03,55.01 83.66,50.64 79.22,50.64 78.11,51.75 C10.2 | X1.1 60.64,77.79 80.17,77.79 82.71,75.25 | 35.56,71.12 v35.56,71.6
  Bottom 0.254: 31.59,53.34 ICSP.6 | 83.19,34.13 C3.2 | 68.9,42.39 IC2.7 | 70.64,52.07 C9.2 | 91.76,44.61 U$2.P$3 | 91.76,51.12 U$2.P$2
  Bottom 0.508: JP12.3 49.53,11.43 49.53,17.3 51.75,19.53 C1.2 | v53.98,21.59 53.98,26.04 C2.2 | JP8.4 JP8.6 JP8.8 JP8.10 10.16,64.93 | 10.16,64.93 JP8.12 | v7.14,47.94 7.14,44.77 6.67,44.29 X2.25 | 31.59,53.34 30,54.93 v30,55.72 31.75,57.47 31.75,64.93 35.56,68.74 v35.56,71.6 | 10.16,64.93 17.78,64.93 17.78,62.58 18.35,60.99 18.35,56.45 JP3.1 | 83.19,34.13 82.07,35.24 82.07,37.47 IC3.5 | 68.9,42.39 70.64,40.64 70.64,39.21 68.9,37.47 IC2.5 | 70.64,52.07 70.64,44.29 68.9,42.55 IC2.7 | 91.76,51.12 91.76,44.61 | JP6.3 93,8.41 93,29.59 X4.P$2
HALLPHASEA  (via drill 0.61)
  Top 0.254: COMM_DIG.1 29.37,16.67 32.07,16.67 v32.23,16.83 | v44.93,39.53 v40.48,39.53 | v44.61,51.91 41.59,54.93 v40.48,54.93 | v40.48,63.02 42.7,65.25 79.85,65.25 86.84,72.23 X3.2
  Bottom 0.254: v32.23,16.83 32.86,16.83 33.02,16.67 33.97,16.67 33.97,16.99 34.92,17.94 34.92,33.97 v40.48,39.53 | v44.93,39.53 44.61,39.85 v44.61,51.91 | v40.48,63.02 v40.48,54.93
HALLPHASEB  (via drill 0.61)
  Top 0.254: COMM_DIG.2 30.96,15.72 34.61,15.72 35.24,16.35 54.29,16.35 54.45,16.19 66.04,16.19 66.2,16.35 70.64,16.35 70.8,16.19 v85.57,16.19
  Bottom 0.254: v85.57,16.19 86.2,16.83 86.2,53.34 84.14,55.4 84.14,72.23 X3.3
HALLPHASEC  (via drill 0.61)
  Top 0.254: v35.56,15.24 36.04,14.76 43.66,14.76 48.42,10 89.38,10 90.33,10.95 90.33,24.29 v87.47,24.29 | v87.31,50.16 86.84,50.64 v85.09,50.64
  Bottom 0.254: COMM_DIG.3 32.54,10.64 34.29,10.64 34.29,13.97 v35.56,15.24 | v87.47,24.29 87.31,24.45 v87.31,50.16 | v85.09,50.64 80.96,54.77 80.96,70.8 80.01,71.75 80.01,73.03 79.22,73.82 70.33,73.82 X3.8
JOYSTICK_CTR  (via drill 0.61)
  Top 0.254: JP9.2 35.88,2.22 42.07,2.22 42.86,3.02 90.65,3.02 91.44,3.81 v91.44,22.7 | v90.49,39.53 94.77,43.81 94.77,47.94 v76.68,47.94 | v73.82,46.99 73.5,47.31 v61.91,47.31
  Bottom 0.254: v91.44,22.7 90.17,23.97 90.17,39.21 v90.49,39.53 | v76.68,47.94 74.14,47.94 74.14,47.31 v73.82,46.99 | v61.91,47.31 58.42,50.8 ADCL.7
JSPARE  (via drill 0.61)
  Top 0.254: v12.86,12.22 14.61,13.97 18.89,13.97 21.91,16.99 22.86,16.99 23.65,17.78 23.65,18.89 23.18,18.89 22.86,19.21 21.59,19.21 20.16,20.64 20.16,28.57 19.05,28.57 18.41,29.21 16.83,29.21 15.56,30.48 XIOH.3
  Bottom 0.254: JP9.8 12.86,10 v12.86,12.22
JSTR  (via drill 0.61)
  Top 0.254: v31.11,9.05 31.59,9.53 v43.02,9.53
  Bottom 0.254: JP9.3 31.11,5.71 v31.11,9.05 | v43.02,9.53 46.67,13.18 46.67,24.92 48.58,26.83 48.58,41.12 48.26,41.43 48.26,53.5 50.8,56.04 ADCL.4
L_STR
  Bottom 0.254: JP5.2 76.2,3.02 79.22,3.02 80.01,3.81 80.01,6.35 78.74,7.62 78.74,17.46 79.22,17.94 R4.2
LED1  (via drill 0.61)
  Top 0.254: XIOH.15 v11.91,15.24
  Bottom 0.254: v11.91,15.24 11.91,20.64 9.21,23.34 X2.5
LED3
  Bottom 0.254: XIOH.13 13.02,15.56 13.02,14.92 12.22,14.13 10.48,14.13 10.48,19.37 9.21,20.64 X2.4
LED4
  Top 0.254: XIOH.12 16.51,21.59 12.86,21.59 9.21,17.94 X2.3
LED5
  Top 0.254: XIOH.11 14.29,20.32 9.21,15.24 X2.2
LED6
  Top 0.254: XIOH.10 19.05,22.86 19.05,19.68 18.41,19.05 14.29,19.05 11.11,15.88 10.79,15.88 10.79,14.13 9.21,12.54 X2.1
LED7
  Top 0.254: XIOH.9 13.18,22.86 9.68,19.37 8.73,19.37 7.3,17.94 6.67,17.94 6.67,16.67 X2.15
LED8
  Bottom 0.254: X2.16 7.78,20.48 7.78,21.27 7.94,21.43 7.94,22.86 7.78,23.02 7.78,23.97 7.94,24.13 7.94,25.4 7.78,25.56 7.78,26.83 7.94,26.99 7.94,28.26 7.78,28.42 7.78,29.69 7.94,29.84 7.94,31.11 7.78,31.27 7.78,32.38 7.94,32.54 7.94,33.81 7.78,33.97 7.78,35.24 7.94,35.4 7.94,36.67 7.78,36.83 7.78,37.94 7.94,38.1 7.94,39.37 7.78,39.53 7.78,40.64 7.94,40.8 7.94,42.07 7.78,42.23 7.78,43.5 7.94,43.66 7.94,44.93 7.78,45.09 7.78,46.04 8.57,46.83 13.49,46.83 13.49,43.02 14.61,41.91 17.78,41.91 XIOL.12
MANRQ  (via drill 0.61)
  Top 0.254: v13.49,30.32 14.61,29.21 15.88,29.21 17.14,27.94 XIOH.6
  Bottom 0.254: v13.49,30.32 13.49,32.86 9.21,37.15 X2.10
MISO+R  (via drill 0.61)
  Top 0.254: v35.56,74.45 35.4,74.61 29.37,74.61 29.05,74.93 v27.62,74.93
  Bottom 0.254: IC1.6 26.19,22.07 26.19,27.3 25.72,27.78 25.72,30.32 26.67,31.27 IC4.6 26.67,33.81 25.4,35.08 25.4,42.55 23.18,42.55 22.07,43.66 22.07,44.29 24.13,46.35 24.13,62.23 25.08,63.18 25.08,69.85 26.19,69.85 27.46,71.12 X5.5 27.62,71.12 v27.62,74.93 | v35.56,74.45 35.56,74.3 46.04,74.3 47.94,72.39 47.94,71.6 48.58,70.96 X1.5
MISO-R  (via drill 0.61)
  Top 0.254: v38.42,65.56 33.5,65.56 31.75,67.31 30.16,67.31 28.89,68.58 X5.4 | v33.66,22.07 32.54,23.18 26.19,23.18 24.45,21.43 IC1.5 | v47.78,17.78 v33.34,17.78 | v51.75,24.45 52.23,24.92 54.61,24.92 60.8,31.11 63.66,31.11 64.29,30.48 v71.6,30.48 | v72.39,66.36 71.91,65.88 55.72,65.88 53.66,67.94 53.66,69.53 51.12,69.53 X1.4
  Bottom 0.254: IC4.5 23.18,32.07 23.18,24.13 24.29,23.02 24.29,21.43 IC1.5 | v38.42,65.56 44.93,72.07 47.31,72.07 47.31,70.48 49.37,68.42 49.85,68.42 X1.4 | v33.66,22.07 33.34,21.75 v33.34,17.78 | v47.78,17.78 51.75,21.75 v51.75,24.45 | v71.6,30.48 71.75,30.64 71.75,36.99 72.55,37.78 72.55,47.31 76.68,51.44 76.68,53.18 72.39,57.47 v72.39,66.36
MOSI+R  (via drill 0.61)
  Top 0.254: R7.2 R11.2 | v39.37,69.37 40.32,68.42 44.77,68.42 X1.8 | v52.39,37.78 43.97,37.78 v43.81,37.62
  Bottom 0.254: IC1.8 32.07,21.43 32.07,21.91 33.18,23.02 33.18,31.59 IC4.8 31.91,33.02 40.24,41.35 | X1.8 44.45,67.94 44.45,58.58 42.23,56.36 42.23,43.34 40.24,41.35 | v39.37,69.37 39.37,73.34 33.97,73.34 31.43,75.88 31.43,76.04 27.3,76.04 23.81,72.55 23.81,68.58 X5.8 | v52.39,37.78 52.39,41.91 R11.2 | v43.81,37.62 40.32,41.12 40.32,41.27 40.24,41.35
MOSI-R  (via drill 0.61)
  Top 0.254: R7.1 R11.1 | X1.7 45.72,70.48 33.81,70.48 33.18,69.85 26.35,69.85 25.08,71.12 X5.7 | v51.75,48.42 51.12,49.05 v41.12,49.05 40.64,49.53 v29.69,49.53
  Bottom 0.254: IC1.7 28.26,22.54 28.26,30.16 28.57,30.48 28.57,32.38 IC4.7 29.05,33.02 28.57,33.5 28.57,38.89 27.94,39.53 27.94,42.39 29.69,44.13 v29.69,49.53 | v51.75,48.42 51.75,51.59 52.23,52.07 R11.1 | v41.12,49.05 41.59,49.53 41.59,66.83 45.56,70.8 46.04,70.8 X1.7
MOTN_JOYSTICK  (via drill 0.61)
  Top 0.254: v29.21,17.78 30.32,18.89 v36.67,18.89 | v43.5,33.18 43.81,33.5 v51.28,33.5 | v54.61,62.87 54.45,63.02 50.32,63.02 ADCL.3
  Bottom 0.254: JP9.4 29.21,6.35 v29.21,17.78 | v36.67,18.89 36.99,19.21 36.99,26.67 v43.5,33.18 | v51.28,33.5 53.98,36.2 53.98,53.66 54.61,54.29 v54.61,62.87
MOVEOK  (via drill 0.61)
  Top 0.254: v57.78,8.89 56.83,7.94 9.21,7.94 1.59,15.56 1.59,21.91 6.51,21.91 X2.17
  Bottom 0.254: PWML.5 57.78,12.06 v57.78,8.89
N$1
  Top 0.254: U$2.P$1 96.84,47.94 95.73,49.05 84.14,49.05 83.19,50.01 77.31,50.01 75.56,51.75 C10.1
  Bottom 0.254: R10.1 71.6,18.1 70.48,19.21 70.48,36.67 71.91,38.1 71.91,48.26 75.41,51.75 C10.1
N$2  (via drill 0.61)
  Top 0.254: v25.4,31.43 26.04,30.8 37.78,30.8 40.64,27.94 v40.96,27.94
  Bottom 0.254: IC4.4 24.77,40.01 24.77,34.77 25.4,34.13 v25.4,31.43 | v40.96,27.94 42.23,26.67 42.23,20.8 41.27,19.84 C6.2
N$3  (via drill 0.61)
  Top 0.254: v25.08,26.04 26.67,24.45 39.21,24.45 40.8,26.04 C7.2
  Bottom 0.254: IC1.4 25.08,28.26 v25.08,26.04
N$4  (via drill 0.61)
  Top 0.254: v93.66,46.83 76.36,46.83 74.14,49.05 63.82,49.05 60.8,52.07 C4.1 | X4.P$1 87.95,31.75 84.45,28.26 R6.1
  Bottom 0.254: v93.66,46.83 93.82,46.67 93.82,42.55 91.6,40.32 91.6,31.75 X4.P$1
N$5
  Top 0.254: IC1.1 34.77,26.19 38.26,26.19 C7.1
N$27  (via drill 0.61)
  Top 0.254: v27.15,67.15 26.99,67.31 6.35,67.31 JP7.5
  Bottom 0.254: ADCH.4 27.15,61.75 v27.15,67.15
N$28  (via drill 0.61)
  Top 0.254: v34.29,72.23 34.13,72.39 13.34,72.39 10.79,69.85 6.35,69.85 JP7.4
  Bottom 0.254: ADCH.5 31.11,61.59 31.11,65.25 34.29,68.42 v34.29,72.23
R_STR
  Bottom 0.254: JP6.2 92.71,3.02 87.15,3.02 81.28,8.89 81.28,17.46 81.76,17.94 R3.2
REGENBAKE  (via drill 0.61)
  Top 0.254: XIOL.11 16.51,39.37 18.57,39.37 20.48,37.47 v42.39,37.47 | v43.5,41.75 43.97,41.27 48.42,41.27 49.05,40.64 59.69,40.64 60.33,41.27 64.45,41.27 66.83,43.66 71.12,43.66 73.34,41.43 77.47,41.43 v80.17,44.13
  Bottom 0.254: v42.39,37.47 43.34,36.51 44.61,36.51 44.61,36.99 44.93,37.31 44.93,38.1 43.5,39.53 v43.5,41.75 | v80.17,44.13 80.17,55.4 80.33,55.56 80.33,70.48 78.74,72.07 78.74,72.23 X3.5
RESERVED  (via drill 0.61)
  Top 0.254: XIOH.2 19.68,34.92 37.47,34.92 37.78,34.61 v45.09,34.61 | v47.15,47.15 47.47,47.47 v50.64,47.47 | v56.04,66.99 60.01,70.96 71.75,70.96 73.03,72.23 X3.7
  Bottom 0.254: v45.09,34.61 47.15,36.67 v47.15,47.15 | v50.64,47.47 50.64,51.44 51.12,51.91 51.12,55.4 52.07,56.36 52.07,63.02 v56.04,66.99
RESET  (via drill 0.61)
  Top 0.254: v34.45,58.74 34.61,58.9 76.68,58.9 POWER.1 79.06,61.28 84.14,61.28 85.25,62.39 U$1.PIN1
  Bottom 0.254: U$1.PIN4 85.41,56.52 85.41,62.39 U$1.PIN1 | v34.45,58.74 34.45,53.5 34.29,53.34 ICSP.5
REVERSE  (via drill 0.61)
  Top 0.254: XIOH.14 18.1,18.1 v22.54,18.1 | v23.02,22.86 23.97,23.81 47.47,23.81 54.61,30.96 v58.9,30.96 | v63.5,66.99 66.83,70.33 79.38,70.33 81.28,72.23 X3.4
  Bottom 0.254: v22.54,18.1 23.02,18.57 v23.02,22.86 | v58.9,30.96 63.02,35.08 63.02,50.64 62.07,51.59 62.07,59.53 63.5,60.96 v63.5,66.99
REVERSE_BUTTON  (via drill 0.61)
  Top 0.254: v19.37,40.01 20.8,38.58 v21.59,38.58
  Bottom 0.254: XIOL.16 19.37,37.15 v19.37,40.01 | v21.59,38.58 21.43,38.42 21.43,17.78 24.45,14.76 26.67,14.76 26.67,6.35 JP9.5
SCK  (via drill 0.61)
  Top 0.254: v48.26,73.82 47.78,73.34 30.48,73.34 v30.32,73.5 | XIOL.2 17.78,52.07 18.57,52.07 19.05,51.59 v28.89,51.59 | v84.3,35.24 83.19,36.35 78.11,36.35 74.45,40.01 IC3.3 73.03,38.73 62.39,38.73 61.28,39.85 IC2.3 61.12,40.01 48.74,40.01 48.1,40.64 39.37,40.64 37.47,42.55 29.53,42.55 v28.1,43.97 | v30.16,66.2 28.89,64.93 v18.89,64.93
  Bottom 0.254: v48.26,73.82 51.12,70.96 X1.3 | v30.32,73.5 30.16,73.34 30.16,71.12 | ICSP.3 34.13,50.8 34.13,52.07 31.11,52.07 30.64,51.59 v28.89,51.59 28.1,50.8 v28.1,43.97 | D8-13.6 83.19,13.34 83.19,25.4 85.57,27.78 85.57,33.97 v84.3,35.24 | v30.16,66.2 30.16,71.12 | v18.89,64.93 19.05,64.77 19.05,54.61 XIOL.2 | 30.16,71.12 X5.3
SELECTAB  (via drill 0.61)
  Top 0.254: v41.12,46.04 v57.63,46.04 | v36.67,53.18 35.24,54.61 28.42,54.61 26.51,52.7 v19.37,52.7
  Bottom 0.254: v57.63,46.04 61.12,42.55 IC2.2 | v41.12,46.04 36.67,50.48 v36.67,53.18 | v19.37,52.7 19.05,52.7 18.41,52.07 16.83,52.07 15.56,53.34 XIOL.1
SELECTCD  (via drill 0.61)
  Top 0.254: IC3.2 76.36,44.61 76.36,46.2 76.04,46.2 73.82,48.42 53.18,48.42 51.44,50.16 41.27,50.16 v40.48,50.96 | v37.94,63.66 37.31,64.29 19.68,64.29 19.21,63.82 v13.34,63.82 | XIOL.5 v12.22,51.28
  Bottom 0.254: v40.48,50.96 39.37,52.07 39.37,62.23 v37.94,63.66 | v13.34,63.82 12.22,62.71 v12.22,51.28
SL_RET
  Bottom 0.254: JP5.1 76.2,7.62 76.2,13.97 73.03,17.14 73.03,26.99 74.14,28.1 R9.2
SL_RTN  (via drill 0.61)
  Top 0.254: v74.45,24.92 76.52,26.99 79.69,26.99 80.49,27.78 80.49,31.43 78.26,31.43 C8.1 78.11,31.59 76.99,32.7 72.55,32.7 69.69,35.56 46.83,35.56 v45.72,36.67
  Bottom 0.254: v74.45,24.92 74.45,18.26 74.3,18.1 R9.1 | ADCL.2 48.42,58.26 48.42,56.52 48.58,56.36 48.58,54.77 46.04,52.23 46.04,36.99 v45.72,36.67
SPARE1
  Top 0.254: XIOL.13 11.11,38.1 9.21,40.01 X2.11
SPARE2
  Bottom 0.254: XIOL.15 13.97,36.83 13.97,37.94 9.21,42.7 X2.12
SPARE3
  Top 0.254: XIOH.5 14.92,27.62 8.57,27.62 7.78,26.83 7.78,25.56 8.57,24.77 10.48,24.77 10.48,22.86 9.68,22.07 8.73,22.07 7.3,20.64 5.08,20.64 5.08,15.24 6.51,13.81 X2.14
SPEEDOMETER  (via drill 0.61)
  Top 0.254: v54.77,17.3 55.09,16.99 70.96,16.99 71.12,16.83 84.77,16.83 v88.11,20.16 | v86.68,67.31 91.12,71.75 91.12,73.82 75.88,73.82 74.61,75.09 X3.14
  Bottom 0.254: PWML.3 54.77,14.13 v54.77,17.3 | v88.11,20.16 88.58,20.64 88.58,53.34 86.68,55.24 v86.68,67.31
SR_RET  (via drill 0.61)
  Top 0.254: v76.99,25.88 77.47,25.4 90.17,25.4 93.66,21.91 93.66,6.67 JP6.1
  Bottom 0.254: v76.99,25.88 76.99,27.94 76.83,28.1 R8.2
SR_RTN  (via drill 0.61)
  Top 0.254: v76.68,20.32 74.3,22.7 v68.26,22.7 | ADCL.1 45.24,63.02 v47.15,63.02 | v49.53,57.78 49.85,58.1 66.52,58.1 v67.79,56.83
  Bottom 0.254: v76.68,20.32 76.68,18.1 R8.1 | v68.26,22.7 66.99,23.97 66.99,51.12 67.94,52.07 C9.1 67.79,52.07 v67.79,56.83 | v47.15,63.02 49.53,63.02 v49.53,57.78
SS3  (via drill 0.61)
  Top 0.254: v21.43,69.85 24.92,69.85 26.19,68.58 X5.6 | v21.59,48.42 21.43,48.26 XIOL.6
  Bottom 0.254: v21.43,69.85 21.59,69.69 v21.59,48.42
SS4  (via drill 0.61)
  Top 0.254: v43.02,71.6 43.5,72.07 47.31,72.07 47.31,68.42 X1.6 | v36.83,57.78 36.67,57.63 30.16,57.63 29.69,58.1 23.5,58.1 22.54,57.15 14.61,57.15 v13.49,56.04
  Bottom 0.254: v43.02,71.6 36.83,65.41 v36.83,57.78 | v13.49,56.04 13.34,55.88 13.34,47.94 15.24,46.04 XIOL.7
STEER
  Bottom 0.254: JP12.2 48.42,2.38 66.04,2.38 PWML.8
STR_L  (via drill 0.61)
  Top 0.254: R4.1 79.22,28.26 78.11,29.37 75.09,29.37 73.03,31.43 C5.1 72.87,31.59 68.74,31.59 v65.88,34.45 | v56.04,56.99 56.2,56.83 v66.36,56.83
  Bottom 0.254: ADCL.6 56.04,60.8 v56.04,56.99 | v66.36,56.83 66.36,34.92 v65.88,34.45
STR_R  (via drill 0.61)
  Top 0.254: v53.5,54.61 53.66,54.77 78.26,54.77 v81.28,51.75
  Bottom 0.254: R3.1 81.92,28.26 83.19,29.53 83.19,31.43 C3.1 83.19,31.59 80.17,34.61 80.17,38.73 83.03,38.73 83.98,39.69 83.98,45.56 83.19,46.35 83.19,49.85 v81.28,51.75 | ADCL.5 53.5,60.8 v53.5,54.61
VIDIN  (via drill 0.61)
  Top 0.254: COMM_DIG.5 33.5,14.76 31.91,14.76 v31.75,14.61 | v30.64,25.56 29.05,27.15 23.5,27.15 18.89,31.75 10.95,31.75 9.68,30.48 6.67,30.48 X2.20
  Bottom 0.254: v31.75,14.61 30.64,15.72 v30.64,25.56
VIN
  Top 0.254: 40.96,66.67 50.8,66.67 X1.2 | 40.96,66.67 33.34,66.67 31.43,68.58 X5.2 | POWER.6 62.87,64.14 43.02,64.14 40.8,61.91 40.16,61.91 39.37,62.71 39.37,65.09 40.96,66.67
WATCHDOG  (via drill 0.61)
  Top 0.254: v57.15,71.44 62.23,76.52 69.37,76.52 70.64,75.25 71.6,75.25 X3.15
  Bottom 0.254: PWML.6 59.05,14.61 59.05,26.99 56.52,29.53 56.52,56.04 57.15,56.67 v57.15,71.44
WHEELROTATION  (via drill 0.61)
  Top 0.254: v42.55,35.72 41.43,36.83 14.61,36.83 10.95,33.18 6.67,33.18 X2.21 | v50.8,30.96 v47.31,30.96
  Bottom 0.254: R1.1 49.53,45.88 50.8,44.61 50.8,34.45 50.16,33.81 50.16,31.75 50.88,31.04 | 50.88,31.04 55.88,26.04 PWML.4 | v47.31,30.96 v42.55,35.72 | v50.8,30.96 50.88,31.04

### Text on the board
tPlace: BND | THR | AIE | ELE | RUD | GER | AUX
tNames: VIN | GND | GND | 5V | 3V3 | RES | G | 9 | 8 | 7 | 6 | 5 | 4 | 3 | 2 | 1 | 0 | 5V | 15 | 14 | 13\ | 12 | 11 | 10 | 53 | 52 | GND | RST | 51 | 50 | MOSI | SCK | MISO | 49 | 48 | 5V | 47 | 46 | 45 | 44 | 43 | 42 | 40 | 41 | 39 | 38 | 36 | 37 | 35 | 34 | 33 | 32 | 31 | 30 | 29 | 28 | 27 | 26 | GND | AREF | 25 | 24 | 23 | 22 | 21 | 20 | 19 | 18 | 17 | 16 | 15 | 14 | 0 | 1 | 2 | 3 | 4 | 5 | 6 | 7 | 8 | 9 | 10 | 11 | 12 | 13 | 5V | GND | STR | 5V | GND | BRK | 5V | 5V | GND | LSTR | SLRE | 5V | GND | RSTR | SRRE
tSilk: Low Level v2.1